# Altium schematic sheet Log and Anti-Log Converters 1.SchDoc
size Letter; SheetNumber: 8; SheetTotal: 14
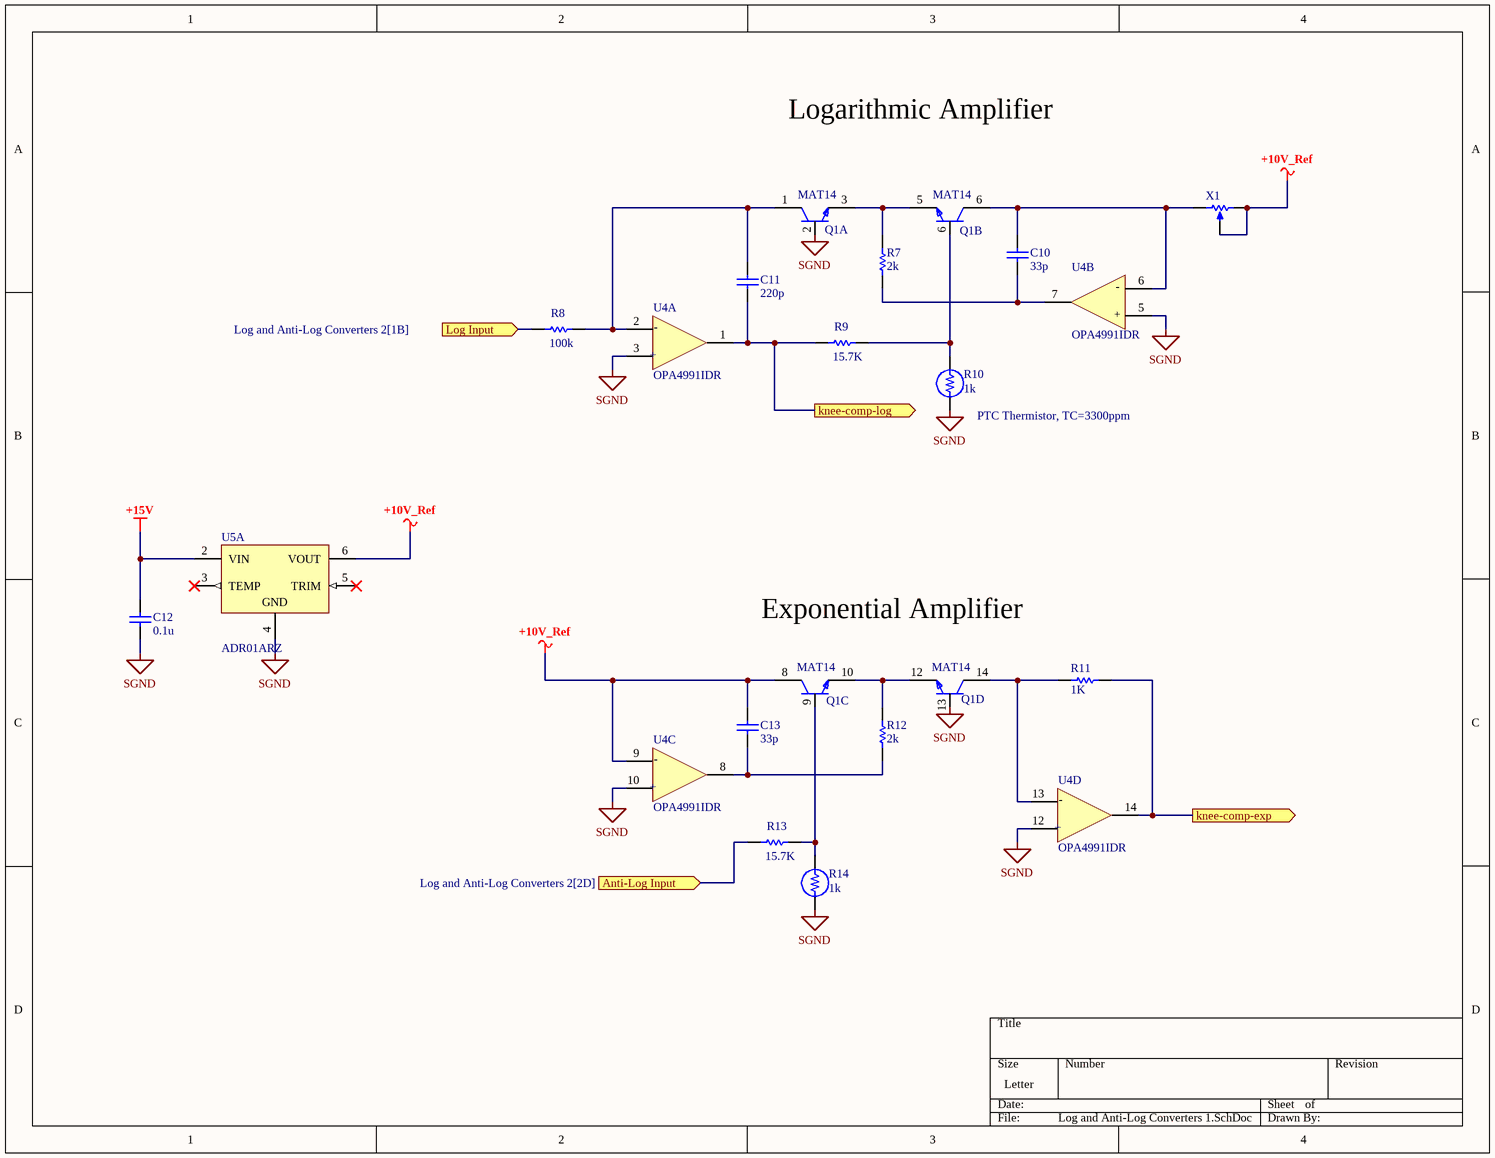
[diagram p0: Log and Anti-Log Converters 1.SchDoc]

## Parts
C10  value 33p  (hidden comment: Capacitor)
C11  value 220p  (hidden comment: Capacitor)
C12  value 0.1u  (hidden comment: Capacitor)
C13  value 33p  (hidden comment: Capacitor)
Q1  MAT14  [FP-R-14-IPC_B]  (parts A,B,C,D of 5)
R7  value 2k  (hidden comment: Resistor)
R8  value 100k  (hidden comment: Resistor)
R9  value 15.7K  (hidden comment: Resistor)
R10  1k
R11  value 1K  (hidden comment: Resistor)
R12  value 2k  (hidden comment: Resistor)
R13  value 15.7K  (hidden comment: Resistor)
R14  1k
U4  OPA4991IDR  [FP-D0014A-IPC_B]  (parts A,B,C,D of 5)
U5  ADR01ARZ  [ADI-R-8_M]  (part A of 2)
X1  Potentiometer  (value not drawn)

## Ports
Anti-Log Input (in, see Log and Anti-Log Converters 2[2D]), knee-comp-exp (out), knee-comp-log (out), Log Input (in, see Log and Anti-Log Converters 2[1B])

## Nets
+10V_Ref: C13.2 Q1.8(C3) U4.9(IN3-) U5.6(VOUT) X1.2(BOT) X1.3(TAP)
+15V: C12.2 U5.2(VIN)
SGND: C12.1 Q1.2(B1) Q1.13(B4) R10.1 R14.1 U4.3(IN1+) U4.5(IN2+) U4.10(IN3+) U4.12(IN4+) U5.4(GND)
Anti-Log Input: R13.2 ; port Anti-Log Input
knee-comp-exp: R11.2 U4.14(OUT4) ; port knee-comp-exp
knee-comp-log: C11.1 R9.2 U4.1(OUT1) ; port knee-comp-log
Log Input: R8.2 ; port Log Input
NetC10_1: C10.1 R7.1 U4.7(OUT2)
NetC10_2: C10.2 Q1.6(C2) U4.6(IN2-) X1.1(TOP)
NetC11_2: C11.2 Q1.1(C1) R8.1 U4.2(IN1-)
NetC13_1: C13.1 R12.1 U4.8(OUT3)
NetQ1_3: Q1.3(E1) Q1.5(E2) R7.2
NetQ1_6: Q1.6(B2) R9.1 R10.2
NetQ1_9: Q1.9(B3) R13.1 R14.2
NetQ1_10: Q1.10(E3) Q1.12(E4) R12.2
NetQ1_14: Q1.14(C4) R11.1 U4.13(IN4-)

Not connected (* = marked no-connect by the designer): U5 3(TEMP)* 5(TRIM)*

## Notes on the sheet
- Logarithmic Amplifier
- (near R10) PTC Thermistor, TC=3300ppm
- Exponential Amplifier
- (in symbol OPA4991IDR, part A) -; +
- (in symbol OPA4991IDR, part B) -; +
- (in symbol OPA4991IDR, part C) -; +
- (in symbol OPA4991IDR, part D) -; +

## Library data of the parts
C10-C13 = Capacitor: SimulationGenericComponent: True
Q1 = MAT14ARZ: TRANS 4NPN 40V 0.03A 14SO; Transition Frequency: 300MHz; Max Collector Current: 30mA; Max Frequency: 1kHz; Collector-emitter Voltage-Max: 60mV; Number of Elements: 4; Polarity: NPN; Max Operating Temperature: 85°C; Collector Emitter Voltage (VCEO): 40V; Collector Emitter Breakdown Voltage: 40V; REACH SVHC: No SVHC; Series: MAT14; Collector Base Voltage (VCBO): 40V; Mount: Surface Mount; Packaging: Rail/Tube; Package Quantity: 56; Case/Package: SOIC; Min Operating Temperature: -40°C; Length: 8.75mm; RoHS Compliant: Yes; Frequency: 300MHz; Radiation Hardening: No; Lead Free: Contains Lead; Collector Emitter Saturation Voltage: 60mV; Height: 1.5mm; Width: 4mm; Number of Pins: 14
R7-R9 R11-R13 = Resistor: TC1: 0; SimulationGenericComponent: True; TC2: 0
R10 R14 = PTC Thermistor
U4 = OPA4991IDR: 40-V, DUAL 4.5MHZ, RAIL-TO-RAIL
U5 = CMP-0784-00317-1: Ultracompact, Precision Voltage Reference, 10 V Output, 12 to 36 V Supply, Industrial, 8-pin SOIC (R-8), Tube; Manufacturer: Analog Devices; Max V Supply (V): 36; Ref Out TC (ppm/C): 3; Min V Supply (V): 12; Vout: 10V; ComponentLink4Description: URL Link1; ComponentLink4URL: Product URL:http://www.analog.com/en/special-linear-functions/voltage-references/adr01/products/product.html; Mounting Technology: Surface Mount; PartNumber: ADR01ARZ; ComponentLink2Description: Datasheet; ComponentLink1URL: http://www.analog.com/en/index.html; PackageReference: R-8; Operating Temp Range: -40 to 125 degC; PackageDescription: 8-Pin Standard Small Outline Package, Body 4.9 x 3.9 mm, Pitch 1.27 mm; ComponentLink3URL: http://www.analog.com/static/imported-files/packages/PKG_PDF/SOIC_Narrow%20(R)/R_8.pdf; Code_JEDEC: MS-012-AA; ComponentLink2URL: http://www.analog.com/static/imported-files/data_sheets/ADR01_02_03_06.pdf; DatasheetVersion: Rev. R; Packing: Tube; PackageVersion: 060506-A, 06/2006; ComponentLink3Description: Package Specification; ComponentLink1Description: Manufacturer URL
X1 = Potentiometer: value: 1k; position: 0.5; SimulationGenericComponent: True